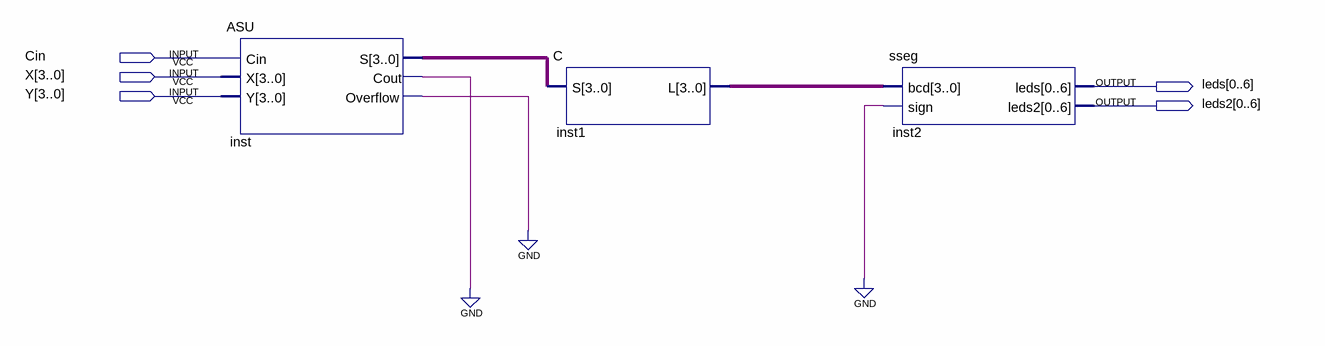
[diagram p0: schematic sheet]
// Quartus schematic CombinedASU2.bdf as structural Verilog: 3 symbols, 5 pins
module CombinedASU2 (
  input  Cin,
  input  [3:0] X,
  input  [3:0] Y,
  output [0:6] leds,
  output [0:6] leds2
);

  wire inst_cout, inst_overflow;
  wire [3:0] inst1_l, inst_s;

  ASU inst (.Cin(Cin), .X(X), .Y(Y), .S(inst_s), .Cout(inst_cout), .Overflow(inst_overflow));
  C inst1 (.S(inst_s), .L(inst1_l));
  sseg inst2 (.bcd(inst1_l), .sign(1'b0), .leds(leds), .leds2(leds2));
  // also tied to GND on the sheet: {inst_cout, inst_overflow}
endmodule
